# EAGLE schematic smartwing (EAGLE 9.6.1)
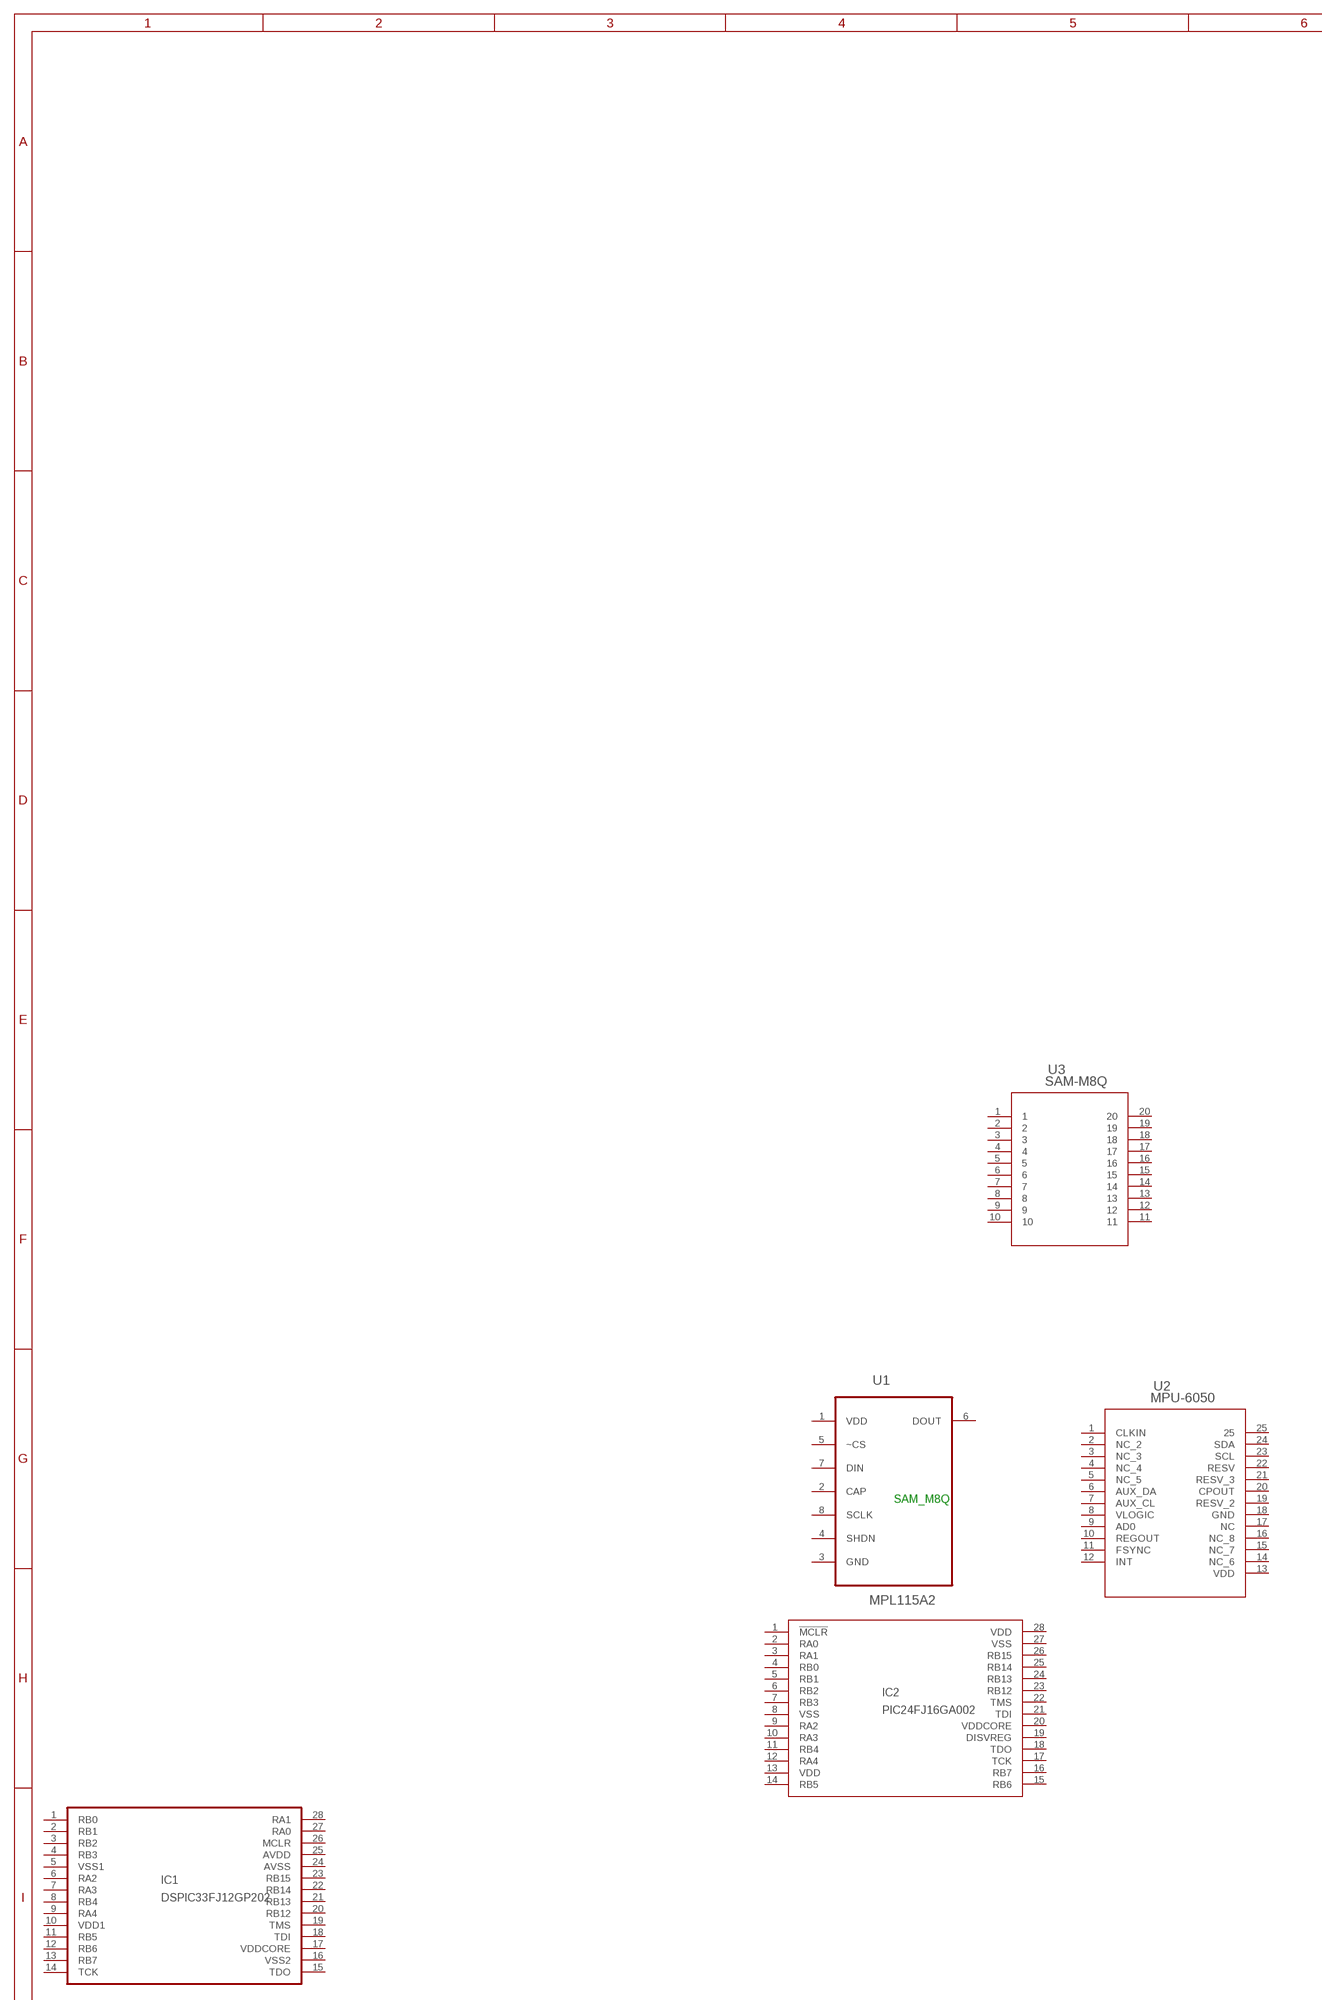
[diagram p0: schematic, sheet 1, part 1 of 2]
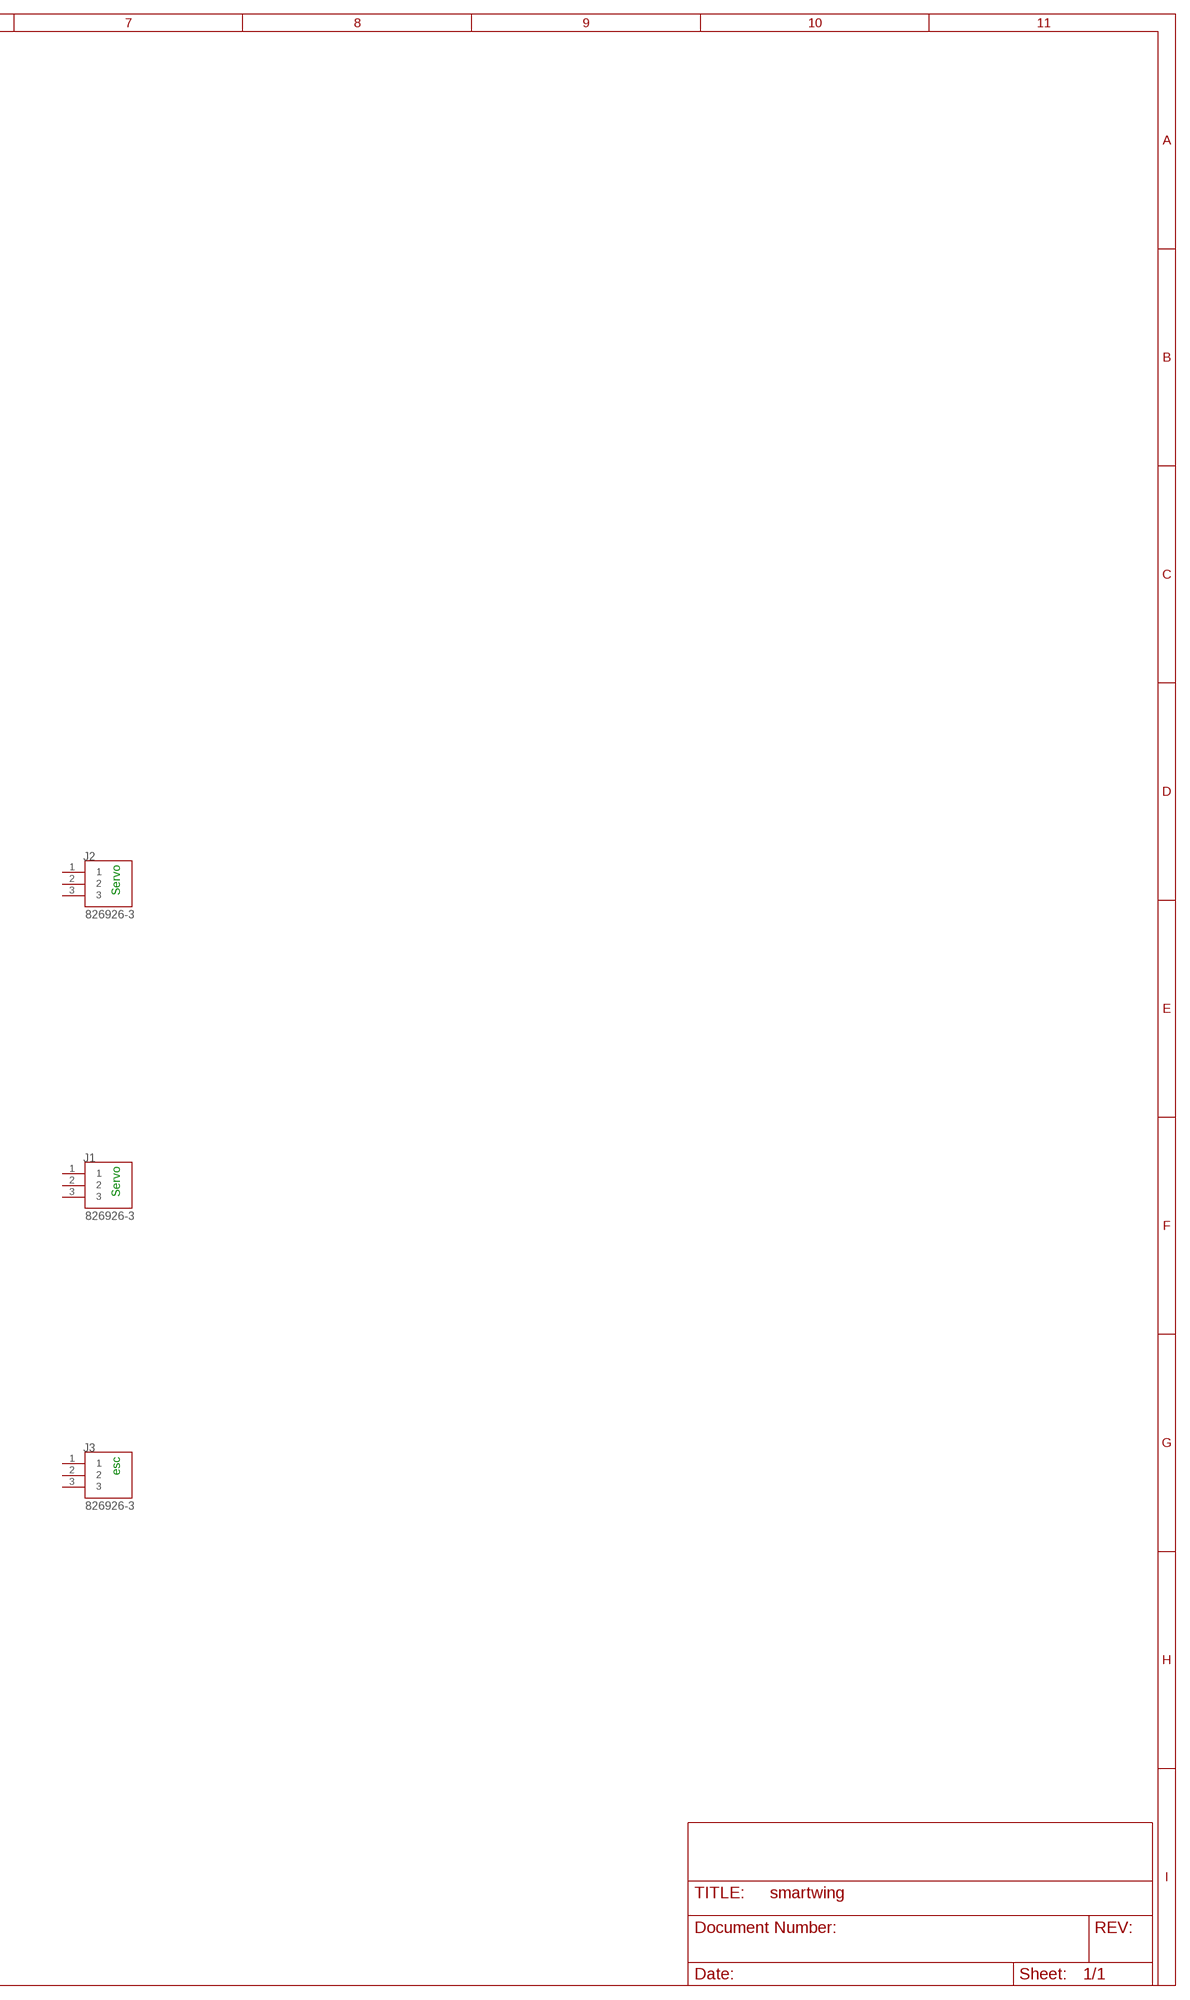
[diagram p1: schematic, sheet 1, part 2 of 2]

## Parts
IC1  DSPIC33FJ12GP202  [QFN28-ML_6X6MM]
IC2  PIC24FJ16GA002  [DIL28-3]
J1  826926-3  [TE_826926-3]
J2  826926-3  [TE_826926-3]
J3  826926-3  [TE_826926-3]
U1  MPL115A2  [LGA8R125P0X4_500X300X120]
U2  MPU-6050  [QFN24_4X4X0P9_IVS]
U3  SAM-M8Q  [QFN_M-M8Q]
Unconnected: IC1.1(RB0) IC1.2(RB1) IC1.3(RB2) IC1.4(RB3) IC1.6(RA2) IC1.7(RA3) IC1.8(RB4) IC1.9(RA4) IC1.11(RB5) IC1.12(RB6) IC1.13(RB7) IC1.14(TCK) IC1.15(TDO) IC1.18(TDI) IC1.19(TMS) IC1.20(RB12) IC1.21(RB13) IC1.22(RB14) IC1.23(RB15) IC1.26(MCLR) IC1.27(RA0) IC1.28(RA1) IC2.1(!MCLR) IC2.2(RA0) IC2.3(RA1) IC2.4(RB0) IC2.5(RB1) IC2.6(RB2) IC2.7(RB3) IC2.9(RA2) IC2.10(RA3) IC2.11(RB4) IC2.12(RA4) IC2.14(RB5) IC2.15(RB6) IC2.16(RB7) IC2.17(TCK) IC2.18(TDO) IC2.19(DISVREG) IC2.21(TDI) IC2.22(TMS) IC2.23(RB12) IC2.24(RB13) IC2.25(RB14) IC2.26(RB15) J1.1 J1.2 J1.3 J2.1 J2.2 J2.3 J3.1 J3.2 J3.3 U1.2(CAP) U1.3(GND) U1.4(SHDN) U1.5(~CS) U1.6(DOUT) U1.7(DIN) U1.8(SCLK) U2.1(CLKIN) U2.2(NC_2) U2.3(NC_3) U2.4(NC_4) U2.5(NC_5) U2.6(AUX_DA) U2.7(AUX_CL) U2.9(AD0) U2.10(REGOUT) U2.11(FSYNC) U2.12(INT) U2.14(NC_6) U2.15(NC_7) U2.16(NC_8) U2.17(NC) U2.18(GND) U2.19(RESV_2) U2.20(CPOUT) U2.21(RESV_3) U2.22(RESV) U2.23(SCL) U2.24(SDA) U2.25 U3.1 U3.3 U3.4 U3.5 U3.6 U3.7 U3.8 U3.9 U3.10 U3.11 U3.12 U3.13 U3.14 U3.15 U3.16 U3.18 U3.19 U3.20

## Notes on the sheet
- Servo
- Servo
- esc
- SAM_M8Q

## Power pins joined to a net without a drawn wire
2: U3.2
17: U3.17
AVDD: IC1.25(AVDD)
AVSS: IC1.24(AVSS)
VDD: IC2.13(VDD) IC2.28(VDD) U1.1(VDD) U2.13(VDD)
VDD1: IC1.10(VDD1)
VDDCORE: IC1.17(VDDCORE) IC2.20(VDDCORE)
VLOGIC: U2.8(VLOGIC)
VSS: IC2.8(VSS) IC2.27(VSS)
VSS1: IC1.5(VSS1)
VSS2: IC1.16(VSS2)

## Library data of the parts
IC1 = microchip:DSPIC33FJ12GP202: dsPIC33FJ12GP202 edit this description Auto generated by make-symbol-device-package-bsdl.ulp Rev. 25 Source: dsPIC33FJ12GP202.bsd; MPN: DSPIC33FJ12GP202-I/ML; OC_FARNELL: unknown; OC_NEWARK: 88K3892
IC2 = microchip:PIC24FJ16GA002: PIC24FJ16GA002 edit this description Auto generated by make-symbol-device-package-bsdl.ulp Rev. 25 Source: PIC24FJ16GA002.bsd; MPN: PIC24FJ16GA002-I/SP; OC_FARNELL: 1816078; OC_NEWARK: 40M1427
J1-J3 = 826926-3:826926-3: 12P MOD2 STIFT LEI; AVAILABILITY: Unavailable; CENTERLINE_PITCH: 2.54 mm[.1 in]; COMMENT: 826926-3; DESCRIPTION: Pin header; pin strips; AMPMODU MOD II; male; PIN: 3; straight; DIGIKEY-PURCHASE-URL: https://snapeda.com/shop?store=DigiKey&id=442070; EU_ROHS_COMPLIANCE: Compliant; MF: TE Connectivity; MP: 826926-3; NUMBER_OF_POSITIONS: 3; PACKAGE: None; PRICE: None; PRODUCT_TYPE: Connector
U1 = untitled:MPL115A2: Miniature SPI Digital Barometer; MPN: MPL115A2; OC_FARNELL: 2102577; OC_NEWARK: 69R5779; PACKAGESTYLE: LGA-8; SUPPLIER: Freescale
U2 = MPU6050:MPU-6050; BUILT_BY: EMA_Cory; COPYRIGHT: Copyright (C) 2018 Accelerated Designs. All rights reserved; MANUFACTURER_PART_NUMBER: MPU-6050; SOURCELIBRARY: InvenSense_2019-12-03; VENDOR: IvenSense
U3 = SAM_M8Q:SAM-M8Q; BUILT_BY: EMA_Matt; COPYRIGHT: Copyright (C) 2018 Accelerated Designs. All rights reserved; DATASHEET: https://datasheet.octopart.com/SAM-M8Q-0-u-blox-datasheet-88027277.pdf; MANUFACTURER_PART_NUMBER: SAM-M8Q; VENDOR: Ublox